# Altium schematic sheet MCU.SchDoc
size A4
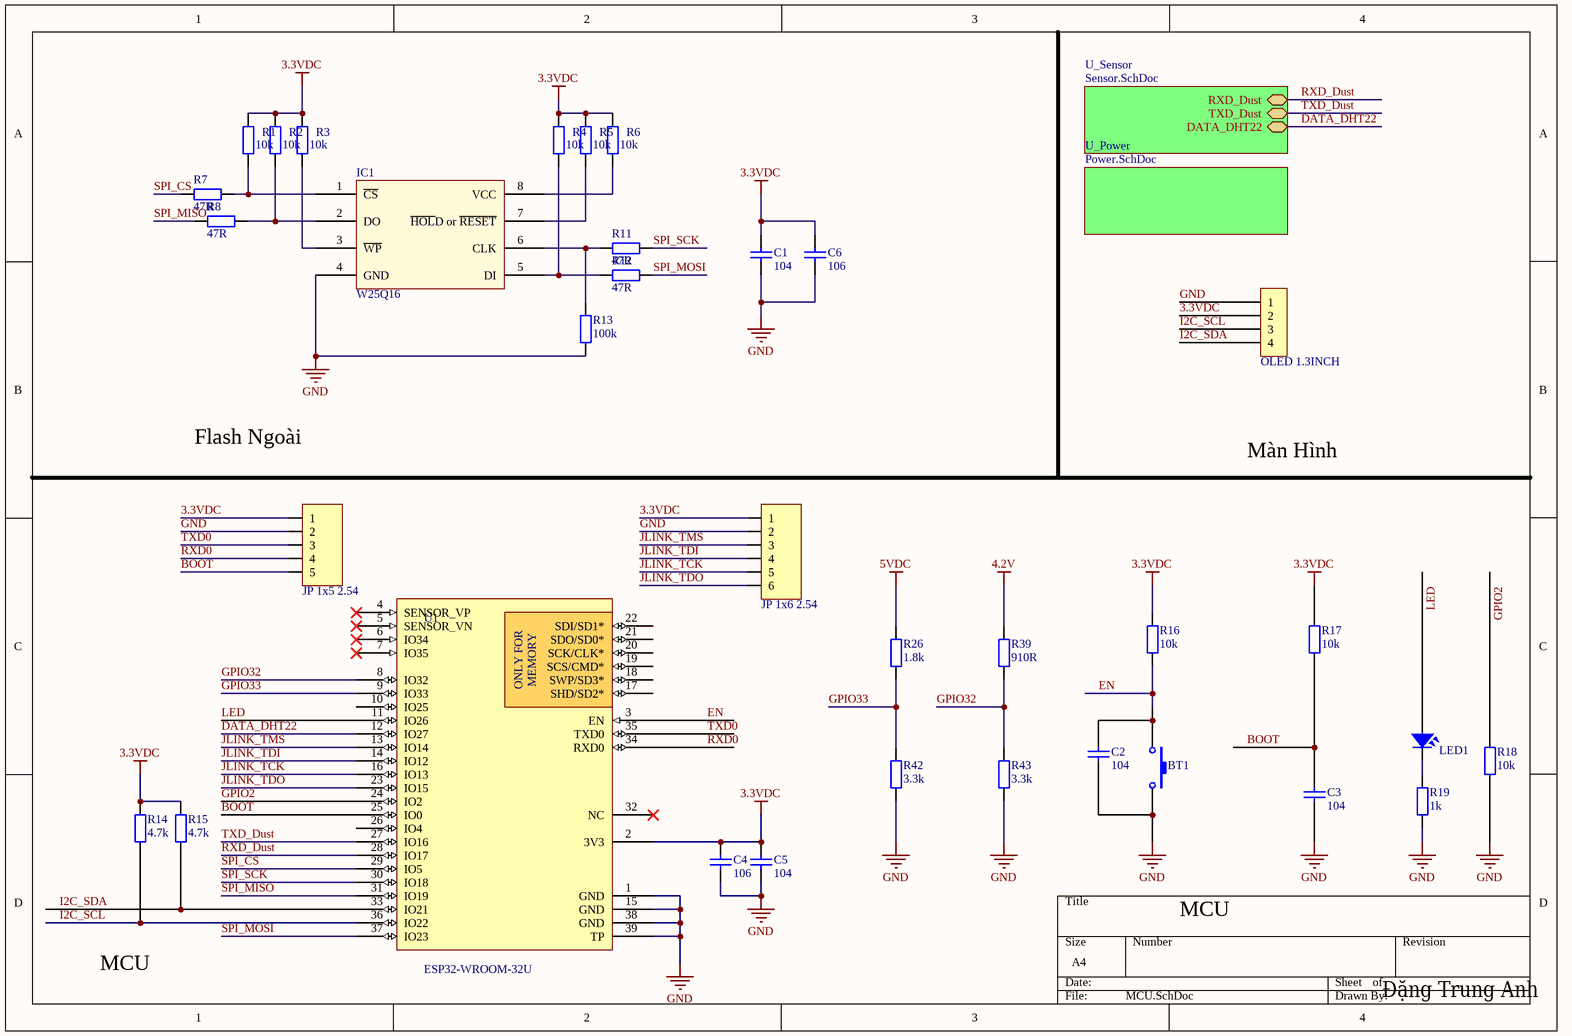
[diagram p0: MCU.SchDoc]

## Parts
BT1  Nut Nhan 2 Chan SMD 3x6x2.5  [Nut Nhan 2 Chan SMD 3x6x2.5]  (value not drawn)
C1  104  [Tu 0805]
C2  104  [tu 0805]
C3  104  [tu 0805]
C4  106  [Tu 0805]
C5  104  [tu 0805]
C6  106  [Tu 0805]
IC1  W25Q16  [W25Q16 -SOIC8]
JP1  OLED 1.3INCH  [JP 1x4 CT - OLED]
JP2  JP 1x5 2.54  [JP 1x5 DT]
JP3  JP 1x6 2.54  [JP 1x6 DT]
LED1  LED SMD  [SM-LED-0805-Blue]  (value not drawn)
R1  10k  [tro smd 0805]
R2  10k  [tro smd 0805]
R3  10k  [tro smd 0805]
R4  10k  [tro smd 0805]
R5  10k  [tro smd 0805]
R6  10k  [tro smd 0805]
R7  47R  [tro smd 0805]
R8  47R  [tro smd 0805]
R11  47R  [tro smd 0805]
R12  47R  [tro smd 0805]
R13  100k  [tro smd 0805]
R14  4.7k  [tro smd 0805]
R15  4.7k  [tro smd 0805]
R16  10k  [tro smd 0805]
R17  10k  [tro smd 0805]
R18  10k  [tro smd 0805]
R19  1k  [tro smd 0805]
R26  1.8k  [tro smd 0805]
R39  910R  [tro smd 0805]
R42  3.3k  [tro smd 0805]
R43  3.3k  [tro smd 0805]
U1  ESP32-WROOM-32U  [ESP32-WROOM-32]

## Sub-sheets
U_Power = Power.SchDoc: no entries
U_Sensor = Sensor.SchDoc: RXD_Dust (bidir), TXD_Dust (bidir), DATA_DHT22 (bidir)

## Nets
3.3VDC: C1.2 C4.1 C5.1 C6.2 JP1.2 JP2.1 JP3.1 R1.2 R2.2 R3.2 R4.2 R5.2 R6.2 R14.2 R15.2 R16.2 R17.2 U1.2(3V3)
4.2V: R39.2
5VDC: R26.2
GND: BT1.2 C1.1 C2.2 C3.2 C4.2 C5.2 C6.1 IC1.4(GND) JP1.1 JP2.2 JP3.2 R13.1 R18.1 R19.1 R42.1 R43.1 U1.1(GND) U1.15(GND) U1.38(GND) U1.39(TP)
BOOT: C3.1 JP2.5 R17.1 U1.25(IO0)
DATA_DHT22: U1.12(IO27) ; sheet U_Sensor/DATA_DHT22
EN: BT1.1 C2.1 R16.1 U1.3(EN)
GPIO2: R18.2 U1.24(IO2)
GPIO32: R39.1 R43.2 U1.8(IO32)
GPIO33: R26.1 R42.2 U1.9(IO33)
I2C_SCL: JP1.3 R14.1 U1.36(IO22)
I2C_SDA: JP1.4 R15.1 U1.33(IO21)
JLINK_TCK: JP3.5 U1.16(IO13)
JLINK_TDI: JP3.4 U1.14(IO12)
JLINK_TDO: JP3.6 U1.23(IO15)
JLINK_TMS: JP3.3 U1.13(IO14)
LED: LED1.1 U1.11(IO26)
RXD0: JP2.4 U1.34(RXD0)
RXD_Dust: U1.28(IO17) ; sheet U_Sensor/RXD_Dust
SPI_CS: R7.1 U1.29(IO5)
SPI_MISO: R8.1 U1.31(IO19)
SPI_MOSI: R12.2 U1.37(IO23)
SPI_SCK: R11.2 U1.30(IO18)
TXD0: JP2.3 U1.35(TXD0)
TXD_Dust: U1.27(IO16) ; sheet U_Sensor/TXD_Dust
NetIC1_1: IC1.1(~{CS}) R1.1 R7.2
NetIC1_2: IC1.2(DO) R2.1 R8.2
NetIC1_3: IC1.3(~{WP}) R3.1
NetIC1_5: IC1.5(DI) R4.1 R12.1
NetIC1_6: IC1.6(CLK) R11.1 R13.2
NetIC1_7: IC1.7(~{HOL}D_or_~{RESET}) R5.1
NetIC1_8: IC1.8(VCC) R6.1
NetLED1_2: LED1.2 R19.2

Not connected (* = marked no-connect by the designer): U1 4(SENSOR_VP)* 5(SENSOR_VN)* 6(IO34)* 7(IO35)* 10(IO25) 17(SHD/SD2*) 18(SWP/SD3*) 19(SCS/CMD*) 20(SCK/CLK*) 21(SDO/SD0*) 22(SDI/SD1*) 26(IO4) 32(NC)*

## Notes on the sheet
- Flash Ngoài
- Màn Hình
- MCU
- Đặng Trung Anh
- (in symbol ESP32-WROOM-32U) ONLY FOR; MEMORY

## Library data of the parts
BT1 = Nut Nhan 2 Chan SMD 3x6x2.5: Ma_Hang: MH001036; Ten: Nút Nhấn 2 Chân 3x6x2.5MM SMD
C1 = Tu 104: Dán; Ten_Linh_Kien: Tụ 0805 104-100nF 10% 50V; Don_Vi: Con; Ma_Hang: MH004551; Kieu_Chan: *; Chung_Loai: Dán; Ghi_Chu: *
C2 C3 C5 = Tu 0805 104 50V 10%: Dán; Don_Vi: Con; So_Chan: 2; Ten_Linh_Kien: Tụ 0805 104-100nF 10% 50V; Ma_Hang: MH004551; Chung_Loai: Dán; Kieu_Chan: *
C4 C6 = Tu 0805 106 16V 10%: Dán; Ten_Linh_Kien: Tụ 0805 106-10uF 10% 16V; So_Chan: 2; Don_Vi: Con; Ma_Hang: MH004553; Chung_Loai: Dán; Kieu_Chan: *
JP1 = JP 1x4 2.54 Cai Thang: Cắm; Ten_Linh_Kien: Jump Đơn Cái 2.54MM 1x20P Thẳng; Don_Vi: Con; Ma_Hang: MH004006; Ghi_Chu: *; Kieu_Chan: *; Chung_Loai: Cắm
JP2 = JP 1x5 2.54 Duc Thang: Cắm; Ten_Linh_Kien: Jump Đơn Đực 2.54MM 1x40P Thẳng 11MM; Don_Vi: Con; Ma_Hang: MH000903; Ghi_Chu: *; Kieu_Chan: *; Chung_Loai: Cắm
JP3 = JP 1x6 2.54 Duc Thang: Cắm; Ten_Linh_Kien: Jump Đơn Đực 2.54MM 1x40P Thẳng 11MM; Don_Vi: Con; Ma_Hang: MH000903; Ghi_Chu: *; Kieu_Chan: *; Chung_Loai: Cắm
LED1 = LED-SMD-0805
R1-R6 = Tro 0805 5% 10k: Dán; Don_Vi: Con; So_Chan: 2; Ten_Linh_Kien: Trở 0805 5% 10k; Ma_Hang: MH005239; Chung_Loai: Dán; Kieu_Chan: *
R7 R8 R11 R12 = Tro 0805 5% 47R: Dán; Don_Vi: Con; So_Chan: 2; Ten_Linh_Kien: Trở 0805 5% 47R; Ma_Hang: MH005321; Chung_Loai: Dán; Kieu_Chan: *
R13 = Tro 0805 5% 100k: Dán; Don_Vi: Con; So_Chan: 2; Ten_Linh_Kien: Trở 0805 5% 100k; Ma_Hang: MH005250; Chung_Loai: Dán; Kieu_Chan: *
R14 R15 = Tro 0805 1% 10k: Dán; Don_Vi: Con; So_Chan: 2; Ten_Linh_Kien: Trở 0805 1% 10k; Ma_Hang: MH005473; Chung_Loai: Dán; Kieu_Chan: *
R16-R18 = Tro 0805 5% 12k: Dán; Don_Vi: Con; So_Chan: 2; Ten_Linh_Kien: Trở 0805 5% 12k; Ma_Hang: MH005241; Chung_Loai: Dán; Kieu_Chan: *
R19 = Tro 0805 5% 100R: Dán; Don_Vi: Con; So_Chan: 2; Ten_Linh_Kien: Trở 0805 5% 100R; Ma_Hang: MH005251; Chung_Loai: Dán; Kieu_Chan: *
R26 = Tro 0805 1% 1.8k: Dán; Don_Vi: Con; So_Chan: 2; Ten_Linh_Kien: Trở 0805 1% 1k; Ma_Hang: MH005468; Chung_Loai: Dán; Kieu_Chan: *
R39 = Tro 0805 1% 910R: Dán; Don_Vi: Con; So_Chan: 2; Ten_Linh_Kien: Trở 0805 1% 9.1k; Ma_Hang: MH008813; Chung_Loai: Dán; Kieu_Chan: *
R42 R43 = Tro 0805 1% 3.3k: Dán; Don_Vi: Con; So_Chan: 2; Ten_Linh_Kien: Trở 0805 1% 3.3k; Ma_Hang: MH005472; Chung_Loai: Dán; Kieu_Chan: *
U1 = ESP32-WROOM-32U: Wi-Fi/BT BLE Module ESP32-D0WD; MFR: Espressif; Solder: SMT; Price: None; Value: ESP32-WROOM-32U; Category: MODULE; MPN: ESP32-WROOM-32U; PinCount: 40